# Altium schematic sheet esp32s3lvgl.SchDoc
size A3
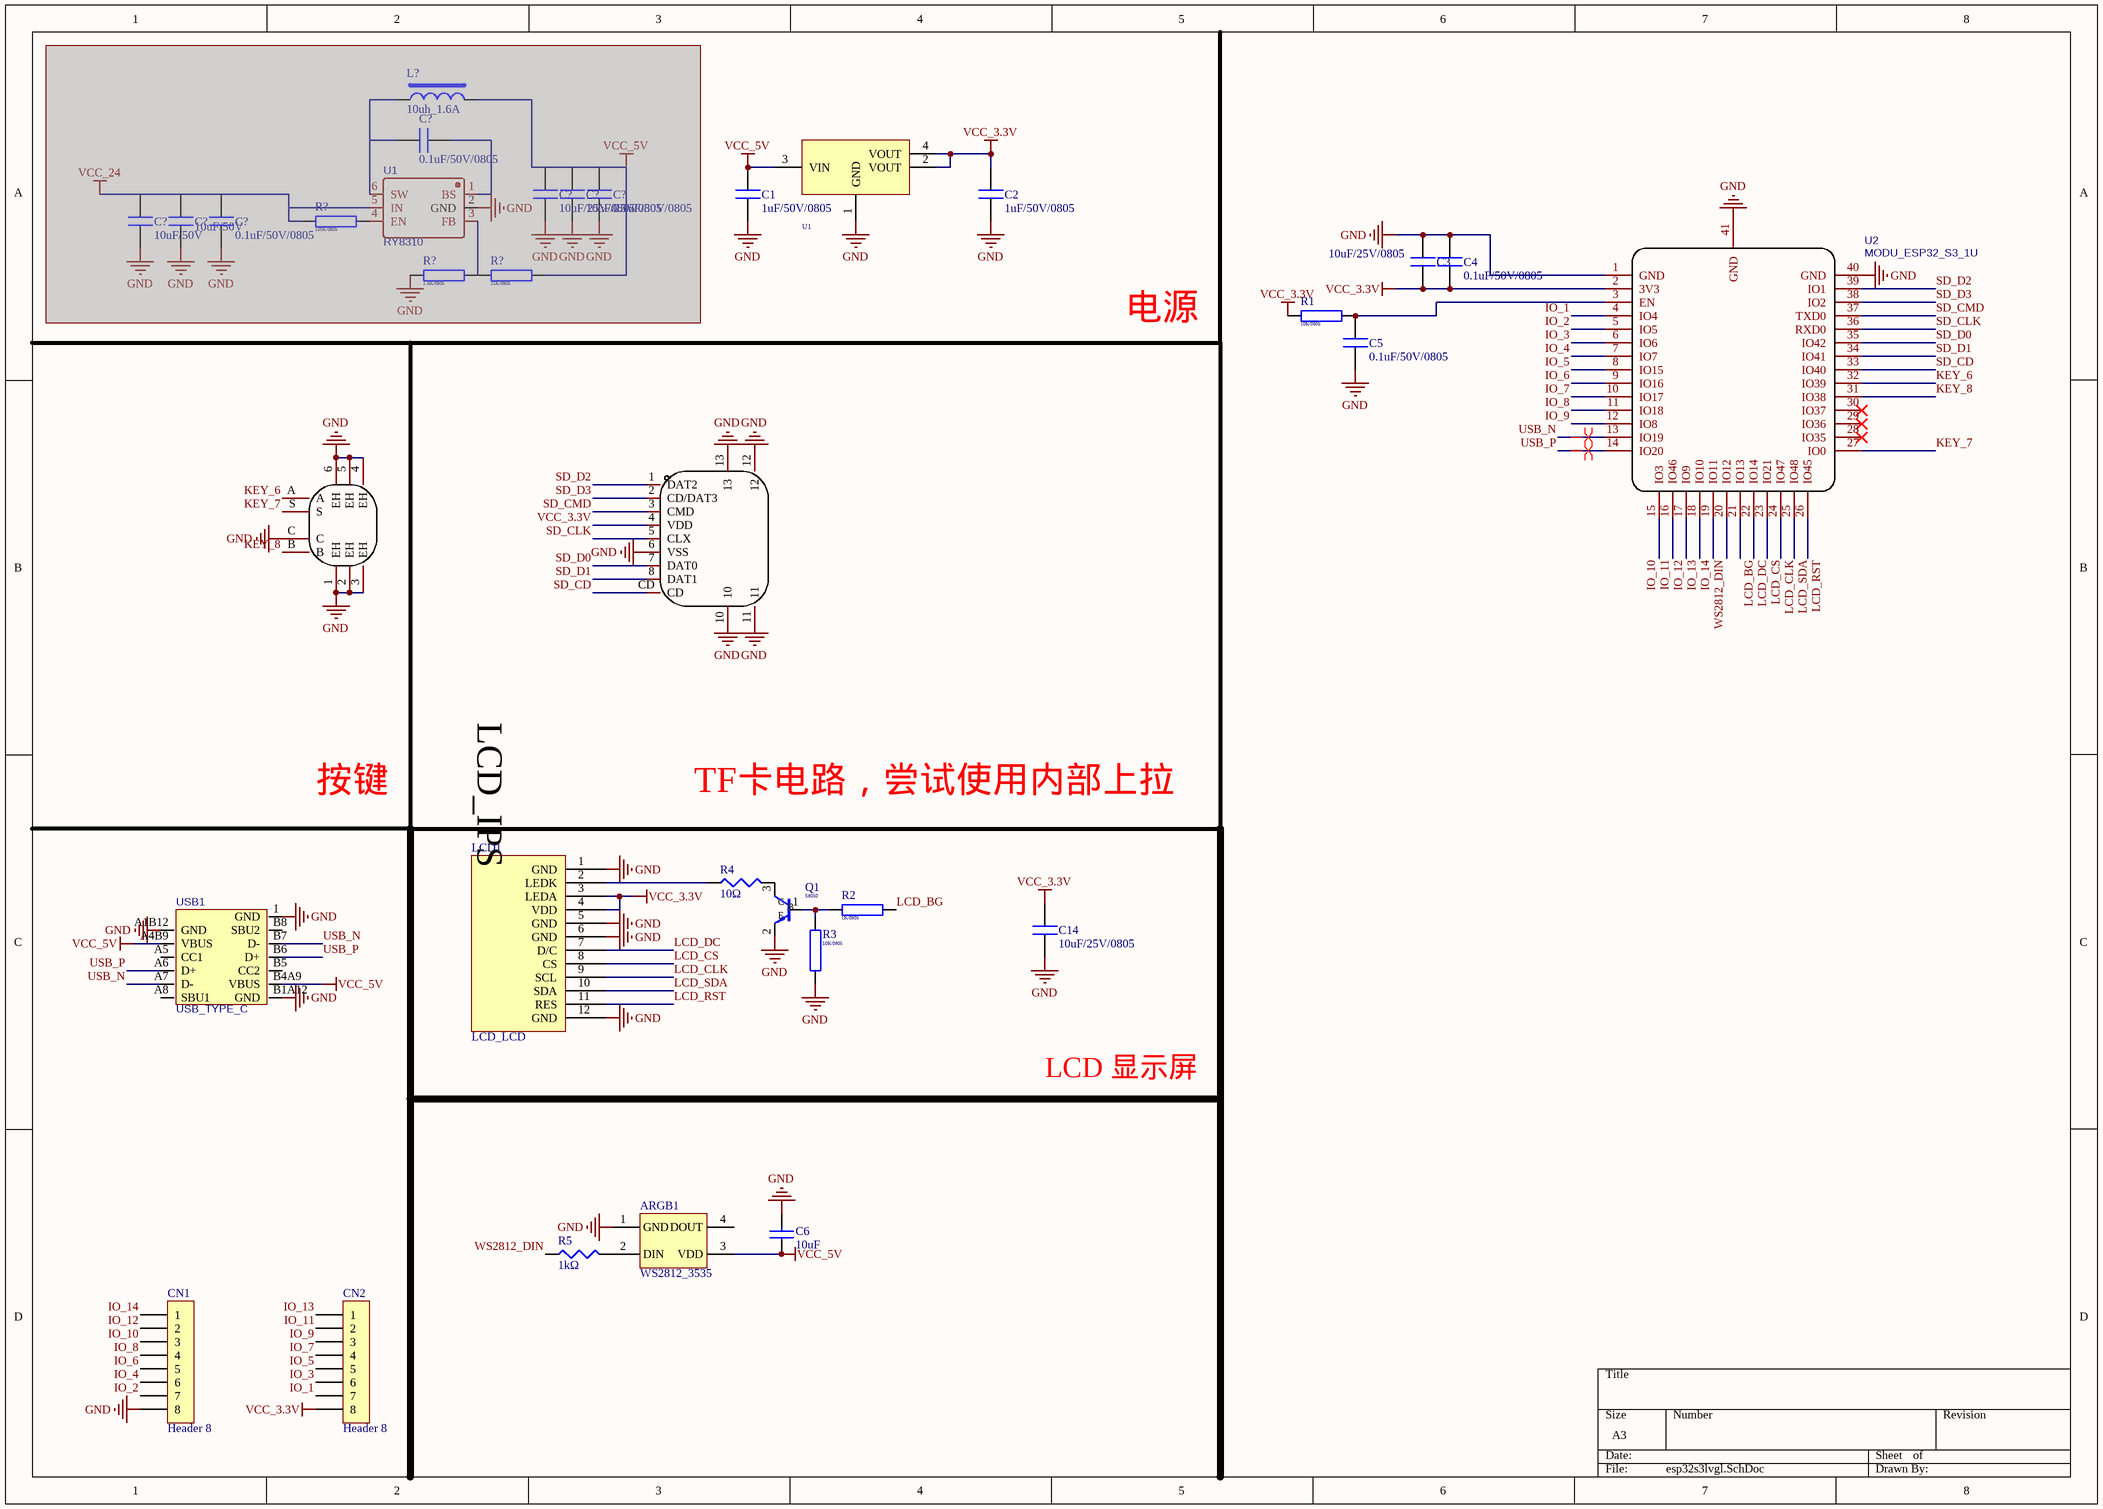
[diagram p0: esp32s3lvgl.SchDoc]

## Parts
(Parts that share a designator on the sheet are numbered #1, #2 ... from top to bottom, then left to right.)
ARGB1  WS2812_3535  [3535_WS2812]
C1  1uF/50V/0805  [C0805]
C2  1uF/50V/0805  [C0805]
C3  10uF/25V/0805  [C0805]
C4  0.1uF/50V/0805  [C0805]
C5  0.1uF/50V/0805  [C0805]
C6  10uF  [C0805]
C14  10uF/25V/0805  [C0805]
C?#1  0.1uF/50V/0805  [C0805]  (masked out: inside a compile mask, not in the netlist)
C?#2  10uF/25V/0805  [C0805]  (masked out: inside a compile mask, not in the netlist)
C?#3  10uF/25V/0805  [C0805]  (masked out: inside a compile mask, not in the netlist)
C?#4  0.1uF/50V/0805  [C0805]  (masked out: inside a compile mask, not in the netlist)
C?#5  10uF/50V  [CAP-1206]  (masked out: inside a compile mask, not in the netlist)
C?#6  10uF/50V  [CAP-1206]  (masked out: inside a compile mask, not in the netlist)
C?#7  0.1uF/50V/0805  [C0805]  (masked out: inside a compile mask, not in the netlist)
CARD1  TF PUSH  [TF-SMD_TF-PUSH]  (value not drawn)
CN1  Header 8  [HDR2.54-LI-8P]
CN2  Header 8  [HDR2.54-LI-8P]
L?  10uh_1.6A  [NR4040]  (masked out: inside a compile mask, not in the netlist)
LCD1  LCD_LCD  [LCD_1.6_IPS]
Q1  S8050  [SOT23-3L]
R1  10K/0805  [R0805]
R2  1K/0805  [R0805]
R3  10K/0805  [R0805]
R4  10Ω  [R1206]
R5  1kΩ  [R0805]
R?#1  100K/0805  [R0805]  (masked out: inside a compile mask, not in the netlist)
R?#2  1.5K/0805  [R0805]  (masked out: inside a compile mask, not in the netlist)
R?#3  21K/0805  [R0805]  (masked out: inside a compile mask, not in the netlist)
U1#1  IC_117-3.3V  [SOT-223]  (value not drawn)
U1#2  RY8310  [SOT-23-6]  (masked out: inside a compile mask, not in the netlist)
U2  MODU_ESP32_S3_1U  [EPS32-S3_1U]
U3  SIQ-02FVS3  [SW-SMD_SIQ-02FVS3_1]  (value not drawn)
USB1  USB_TYPE_C  [USB-type_C]

## Nets
GND: ARGB1.1(GND) C1.1 C2.1 C3.2 C4.2 C5.1 C6.2 C14.1 CARD1.6(VSS) CARD1.10 CARD1.11 CARD1.12 CARD1.13 CN1.8 LCD1.1(GND) LCD1.5(GND) LCD1.6(GND) LCD1.12(GND) Q1.2(E) R3.1 U1#1.1(GND) U2.1(GND) U2.40(GND) U2.41(GND) U3.1(EH) U3.2(EH) U3.3(EH) U3.4(EH) U3.5(EH) U3.6(EH) U3.C USB1.1(GND) USB1.A1B12(GND) USB1.B1A12(GND)
VCC_3.3V: C2.2 C3.1 C4.1 C14.2 CARD1.4(VDD) CN2.8 LCD1.3(LEDA) LCD1.4(VDD) R1.1 U1#1.2(VOUT) U1#1.4(VOUT) U2.2(3V3)
VCC_5V: ARGB1.3(VDD) C1.2 C6.1 U1#1.3(VIN) USB1.A4B9(VBUS) USB1.B4A9(VBUS)
IO_1: CN2.7 U2.4(IO4)
IO_2: CN1.7 U2.5(IO5)
IO_3: CN2.6 U2.6(IO6)
IO_4: CN1.6 U2.7(IO7)
IO_5: CN2.5 U2.8(IO15)
IO_6: CN1.5 U2.9(IO16)
IO_7: CN2.4 U2.10(IO17)
IO_8: CN1.4 U2.11(IO18)
IO_9: CN2.3 U2.12(IO8)
IO_10: CN1.3 U2.15(IO3)
IO_11: CN2.2 U2.16(IO46)
IO_12: CN1.2 U2.17(IO9)
IO_13: CN2.1 U2.18(IO10)
IO_14: CN1.1 U2.19(IO11)
KEY_6: U2.32(IO39) U3.A
KEY_7: U2.27(IO0) U3.S
KEY_8: U2.31(IO38) U3.B
LCD_BG: R2.2 U2.21(IO13)
LCD_CLK: LCD1.9(SCL) U2.24(IO47)
LCD_CS: LCD1.8(CS) U2.23(IO21)
LCD_DC: LCD1.7(D/C) U2.22(IO14)
LCD_RST: LCD1.11(RES) U2.26(IO45)
LCD_SDA: LCD1.10(SDA) U2.25(IO48)
SD_CD: CARD1.CD U2.33(IO40)
SD_CLK: CARD1.5(CLX) U2.36(RXD0)
SD_CMD: CARD1.3(CMD) U2.37(TXD0)
SD_D0: CARD1.7(DAT0) U2.35(IO42)
SD_D1: CARD1.8(DAT1) U2.34(IO41)
SD_D2: CARD1.1(DAT2) U2.39(IO1)
SD_D3: CARD1.2(CD/DAT3) U2.38(IO2)
USB_N: U2.13(IO19) USB1.A7(D-) USB1.B7(D-)
USB_P: U2.14(IO20) USB1.A6(D+) USB1.B6(D+)
WS2812_DIN: R5.1 U2.20(IO12)
NetARGB1_2: ARGB1.2(DIN) R5.2
NetC5_2: C5.2 R1.2 U2.3(EN)
NetLCD1_2: LCD1.2(LEDK) R4.1
NetQ1_1: Q1.1(B) R2.1 R3.2
NetQ1_3: Q1.3(C) R4.2

Not connected (* = marked no-connect by the designer): ARGB1 4(DOUT); U2 28(IO35)* 29(IO36)* 30(IO37)*; USB1 A5(CC1) A8(SBU1) B5(CC2) B8(SBU2)

## Layout directives
differential pair: USB_N, USB_P

## Notes on the sheet
- 电源
- 按键
- TF卡电路，尝试使用内部上拉
- LCD 显示屏
- (in symbol LCD_1.6_240*280) LCD_IPS

## Library data of the parts
ARGB1 = WS2812_3535: ARGB 3535 灯珠
C1 C2 = C0805_1uF_20%_50V: 片状电容 0805 1uF 20% 50V; 编码: C2798196; 单价: 0.029832; 插位说明: SMT
C3 C?#2 C?#3 = C0805_10uF_20%_25V: 片状电容 0805 10uF 20% 25V; 编码: C2922480; 单价: 0.039376; 插位说明: SMT
C4 C5 C?#1 C?#4 C?#7 = C0805_0.1uF_20%_50V: 片状电容 0805 0.1uF 20% 50V; 编码: C1711; 单价: 0.018663; 插位说明: SMT
C6 = C0805_10uF
C14 = C0805_10uF_20%_25V: 片状电容 0805 10uF 20% 25V; 编码: C15850; 单价: 0.0595; 插位说明: SMT
C?#5 C?#6 = C1206_10uF_20%_50V: 片状电容 1206 10uF 20% 50V; 编码: C13585; 单价: 0.129485; 插位说明: SMT
CARD1 = TF PUSH: Manufacturer: SHOU HAN(首韩); Add into BOM: yes; Card Type: MicroSD卡(TF卡); Connector Type: 卡座; Card Connection Mode: 自弹式; Maximum Body Height: 2mm; Name: TF PUSH; Symbol: TF PUSH; Device: TF PUSH; LCSC Part Name: 自弹式TF卡座 TF外焊式内存卡卡座; Supplier Part: C393941; Manufacturer Part: TF PUSH; Supplier Footprint: SMD; JLCPCB Part Class: Extended Part; Datasheet: https://atta.szlcsc.com/upload/public/pdf/source/20191011/C393941_0DDD896EE907FEB750D8B7B8982E2A67.pdf; Supplier: LCSC; Convert to PCB: yes; Operating Temperature Range: -20℃~+90℃
CN1 CN2 = HDR_8P_2.54: 2.54x8P 单排连接器; 插位说明: HI; Code: *; Price: *
L? = NR4040_10uH
LCD1 = LCD_1.6_240*280: 1.6寸isp显示屏，spi口
Q1 = BJT-NPN-8050: NPN 三极管 8050  Ic：1.5A Vce=25 额定功率300mW; 编码: C444722; 单价: 0.054387; 插位说明: SMT
R1 R3 = R0805_10K_1%_0.125W: 片状电阻 0805 10KΩ±1% 0.125W; 单价: 0.012277; 编码: C17414; 插位说明: SMT
R2 = R0805_1K_1%_0.125W: 片状电阻 0805 1K±1% 0.125W; 单价: 0.00901; 编码: C17513; 插位说明: SMT
R4 = R1206_10Ω
R5 = R0805_1kΩ
R?#1 = R0805_100K_1%_0.125W: 片状电阻 0805 100K±1% 0.125W; 单价: 0.011245; 编码: C101406; 插位说明: SMT
R?#2 = R0805_1.5K_1%_0.125W: 片状电阻 0805 1.5K±1% 0.125W; 单价: 0.006205; 编码: C2907290; 插位说明: SMT
R?#3 = R0805_21K_1%_0.1W: 片状电阻 0805 21KΩ±1% 0.125W; 单价: 0.009616; 编码: C422798; 插位说明: SMT
U1#1 = IC_1117B-3.3V: 线性稳压IC 3.3V 最大输入电压 15V 压降1.2V@800mA; 插位说明: SMT; 单价: 0.317852; 编码: C347222
U1#2 = IC_RY8310: DC-DC同步整流降压电源芯片 / 输入电压（最大值） 4V-30V / 工作频率  1.4Mhz / 最大效率  90%; 编码: C370876; 单价: 0.7841; 插位说明: SMT
U2 = MODU_ESP32_S3_1U: BOM_Manufacturer: ESPRESSIF 乐鑫; BOM_Manufacturer Part: ESP32-S3-WROOM-1U-N8R8; Contributor: LCSC; BOM_Supplier: LCSC; BOM_Supplier Part: C2980300; link: https://atta.szlcsc.comnull; BOM_JLCPCB Part Class: Extended Part; spicePre: U; spiceSymbolName: ESP32-S3-WROOM-1U-N8R8
U3 = SIQ-02FVS3: Add into BOM: yes; Name: =Manufacturer Part; Symbol: SIQ-02FVS3; Device: SIQ-02FVS3; LCSC Part Name: 拨轮滚轮旋转编码器开关; Supplier Part: C2925423; JLCPCB Part Class: Extended Part; Datasheet: https://atta.szlcsc.com/upload/public/pdf/source/20220728/2FBC1A98A06DC86460FC69DAE20456FC.pdf; Supplier: LCSC; Convert to PCB: yes
USB1 = CON_USB_TYPE_C: BOM_Manufacturer: 韩国韩荣; BOM_Manufacturer Part: TYPE-C-31-M-09; Contributor: LCSC; BOM_Supplier: LCSC; BOM_Supplier Part: C2689967; BOM_JLCPCB Part Class: Extended Part; spicePre: U; spiceSymbolName: TYPE-C-31-M-09